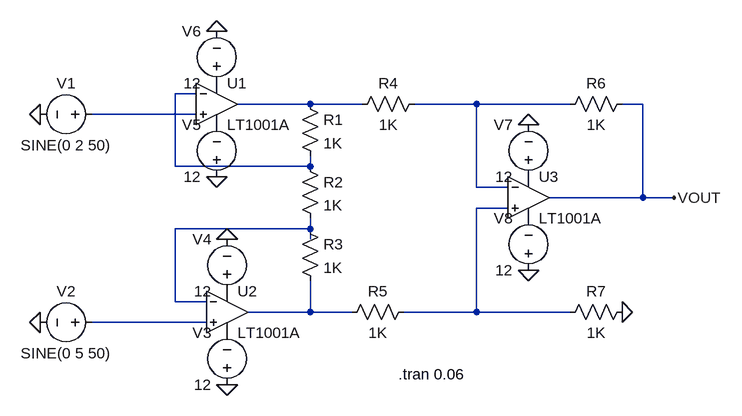
[diagram p0: schematic Instrumentation Amplifier.asc]
Instrumentation Amplifier.asc, the LTspice schematic file:
Version 4
SHEET 1 880 680
WIRE 48 64 16 64
WIRE 224 80 112 80
WIRE 304 80 224 80
WIRE 480 80 384 80
WIRE 624 80 480 80
WIRE 736 80 704 80
WIRE 48 96 -112 96
WIRE 16 176 16 64
WIRE 224 176 224 160
WIRE 224 176 16 176
WIRE 480 208 480 80
WIRE 528 208 480 208
WIRE 736 224 736 80
WIRE 736 224 592 224
WIRE 784 224 736 224
WIRE 528 240 480 240
WIRE 224 272 224 256
WIRE 224 272 16 272
WIRE 224 288 224 272
WIRE 16 384 16 272
WIRE 64 384 16 384
WIRE 224 400 224 352
WIRE 224 400 128 400
WIRE 288 400 224 400
WIRE 480 400 480 240
WIRE 480 400 368 400
WIRE 624 400 480 400
WIRE 64 416 -112 416
FLAG 704 400 0
FLAG -192 96 0
FLAG -192 416 0
FLAG 784 224 VOUT
FLAG 80 -32 0
FLAG 80 192 0
FLAG 96 288 0
FLAG 96 512 0
FLAG 560 336 0
FLAG 560 112 0
SYMBOL OpAmps\\LT1001A 80 16 R0
SYMATTR InstName U1
SYMBOL OpAmps\\LT1001A 96 336 R0
SYMATTR InstName U2
SYMBOL OpAmps\\LT1001A 560 160 R0
SYMATTR InstName U3
SYMBOL res 208 64 R0
SYMATTR InstName R1
SYMATTR Value 1K
SYMBOL res 208 160 R0
SYMATTR InstName R2
SYMATTR Value 1K
SYMBOL res 208 256 R0
SYMATTR InstName R3
SYMATTR Value 1K
SYMBOL voltage -96 96 R90
WINDOW 0 -32 56 VBottom 2
WINDOW 3 32 56 VTop 2
WINDOW 123 0 0 Left 0
WINDOW 39 0 0 Left 0
SYMATTR InstName V1
SYMATTR Value SINE(0 2 50)
SYMBOL voltage -96 416 R90
WINDOW 0 -32 56 VBottom 2
WINDOW 3 32 56 VTop 2
WINDOW 123 0 0 Left 0
WINDOW 39 0 0 Left 0
SYMATTR InstName V2
SYMATTR Value SINE(0 5 50)
SYMBOL res 400 64 R90
WINDOW 0 0 56 VBottom 2
WINDOW 3 32 56 VTop 2
SYMATTR InstName R4
SYMATTR Value 1K
SYMBOL res 384 384 R90
WINDOW 0 0 56 VBottom 2
WINDOW 3 32 56 VTop 2
SYMATTR InstName R5
SYMATTR Value 1K
SYMBOL res 720 64 R90
WINDOW 0 0 56 VBottom 2
WINDOW 3 32 56 VTop 2
SYMATTR InstName R6
SYMATTR Value 1K
SYMBOL res 720 384 R90
WINDOW 0 0 56 VBottom 2
WINDOW 3 32 56 VTop 2
SYMATTR InstName R7
SYMATTR Value 1K
SYMBOL voltage 96 528 R180
WINDOW 0 24 96 Left 2
WINDOW 3 24 16 Left 2
WINDOW 123 0 0 Left 0
WINDOW 39 0 0 Left 0
SYMATTR InstName V3
SYMATTR Value 12
SYMBOL voltage 96 384 R180
WINDOW 0 24 96 Left 2
WINDOW 3 24 16 Left 2
WINDOW 123 0 0 Left 0
WINDOW 39 0 0 Left 0
SYMATTR InstName V4
SYMATTR Value 12
SYMBOL voltage 80 208 R180
WINDOW 0 24 96 Left 2
WINDOW 3 24 16 Left 2
WINDOW 123 0 0 Left 0
WINDOW 39 0 0 Left 0
SYMATTR InstName V5
SYMATTR Value 12
SYMBOL voltage 80 64 R180
WINDOW 0 24 96 Left 2
WINDOW 3 24 16 Left 2
WINDOW 123 0 0 Left 0
WINDOW 39 0 0 Left 0
SYMATTR InstName V6
SYMATTR Value 12
SYMBOL voltage 560 208 R180
WINDOW 0 24 96 Left 2
WINDOW 3 24 16 Left 2
WINDOW 123 0 0 Left 0
WINDOW 39 0 0 Left 0
SYMATTR InstName V7
SYMATTR Value 12
SYMBOL voltage 560 352 R180
WINDOW 0 24 96 Left 2
WINDOW 3 24 16 Left 2
WINDOW 123 0 0 Left 0
WINDOW 39 0 0 Left 0
SYMATTR InstName V8
SYMATTR Value 12
TEXT 360 496 Left 2 !.tran 0.06

The netlist it stands for:
* Instrumentation Amplifier.asc
XU1 N004 N001 P001 P002 N002 LT1001  ; LT1001A, pins In+ In- V+ V- OUT
XU2 N008 N006 P003 P004 N007 LT1001  ; LT1001A, pins In+ In- V+ V- OUT
XU3 N005 N003 P005 P006 VOUT LT1001  ; LT1001A, pins In+ In- V+ V- OUT
R1 N002 N001 1K
R2 N001 N006 1K
R3 N006 N007 1K
V1 N004 0 SINE(0 2 50)
V2 N008 0 SINE(0 5 50)
R4 N003 N002 1K
R5 N005 N007 1K
R6 VOUT N003 1K
R7 0 N005 1K
V3 0 P004 12
V4 P003 0 12
V5 0 P002 12
V6 P001 0 12
V7 P005 0 12
V8 0 P006 12
.tran 0.06
.lib LTC.lib
.backanno
.end